# Altium schematic sheet 03 TF CARD, SATA.SchDoc
size 513 x 386 mm
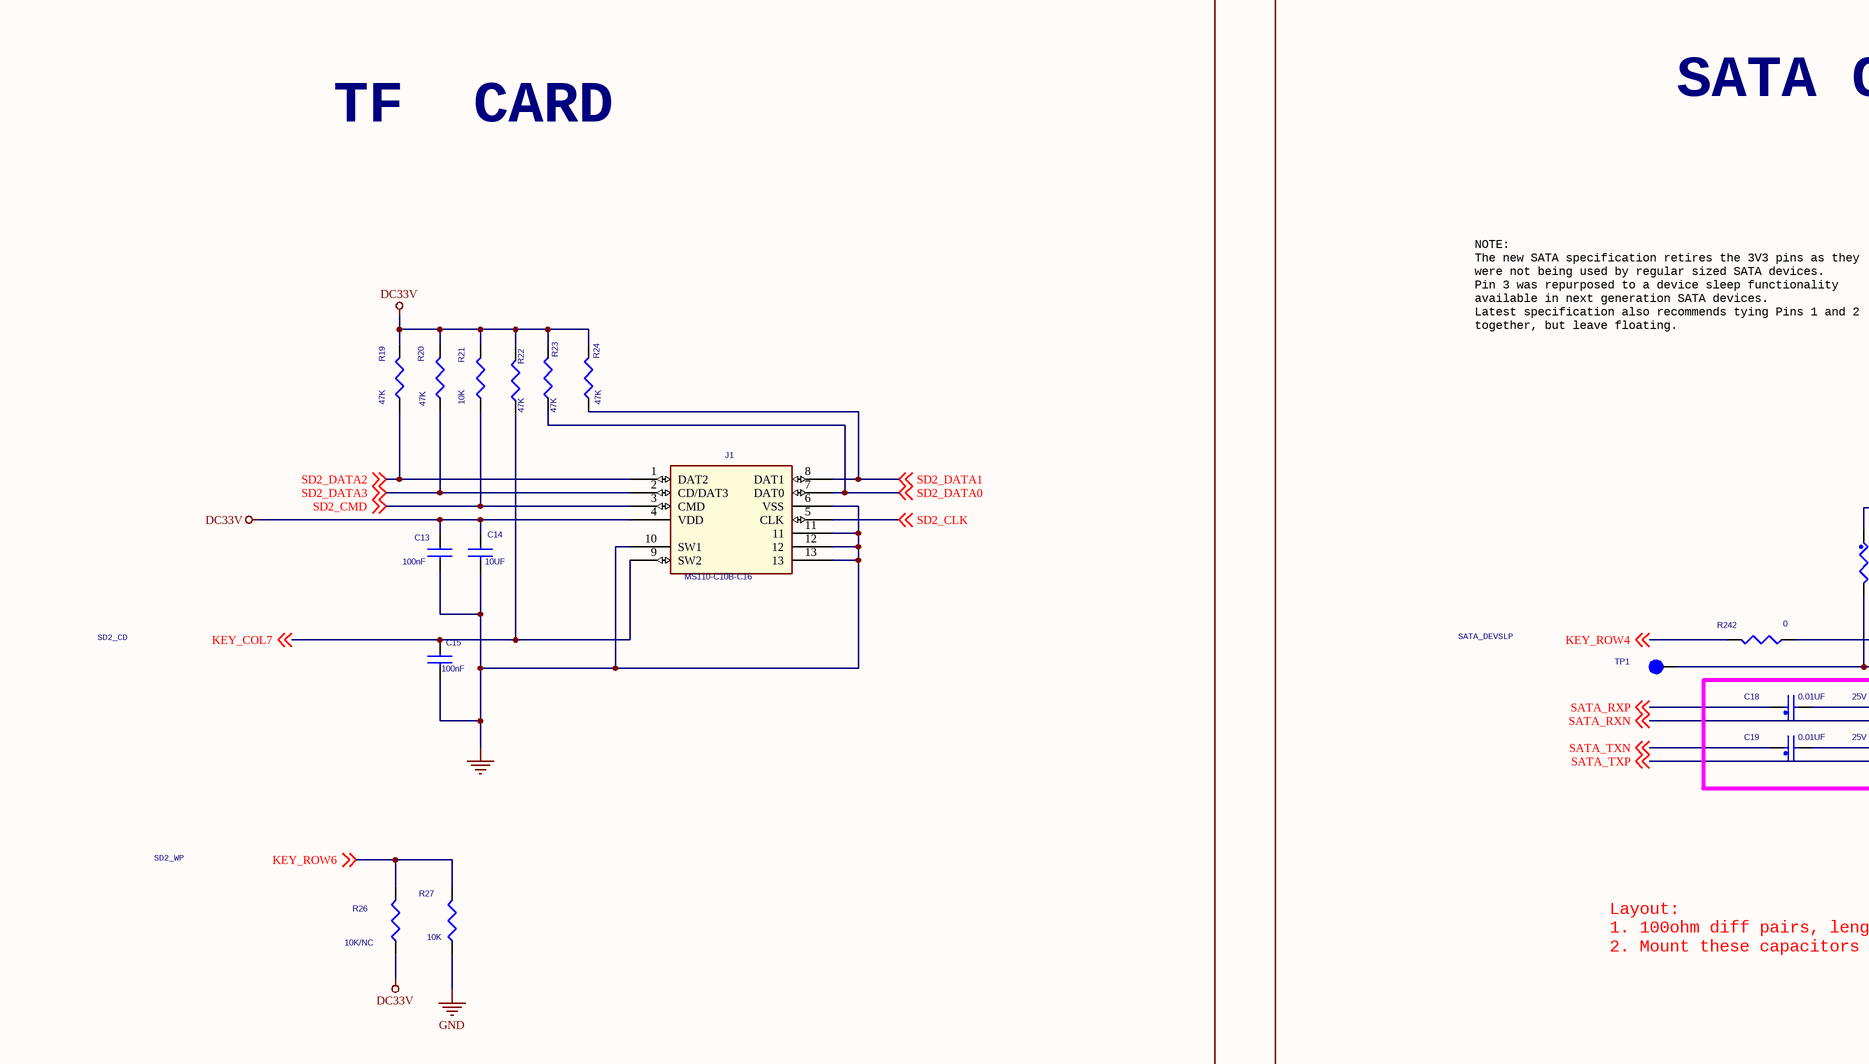
[diagram p0: 03 TF CARD, SATA.SchDoc, top left]
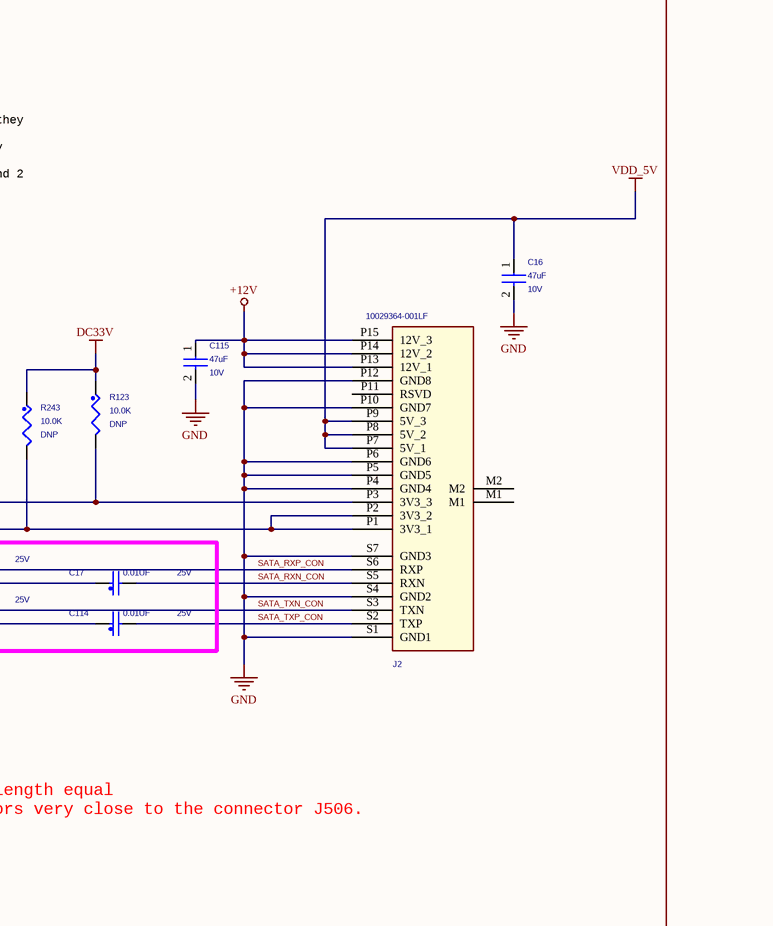
[diagram p1: 03 TF CARD, SATA.SchDoc, top right]
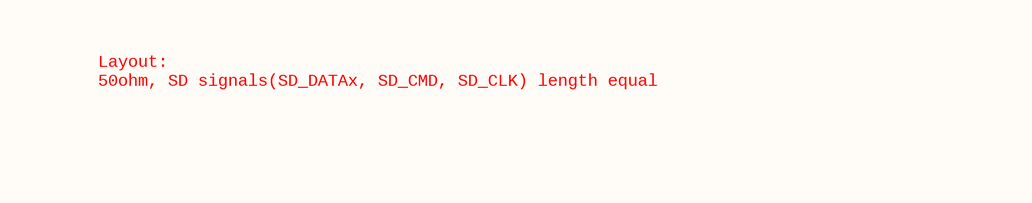
[diagram p2: 03 TF CARD, SATA.SchDoc, bottom left]
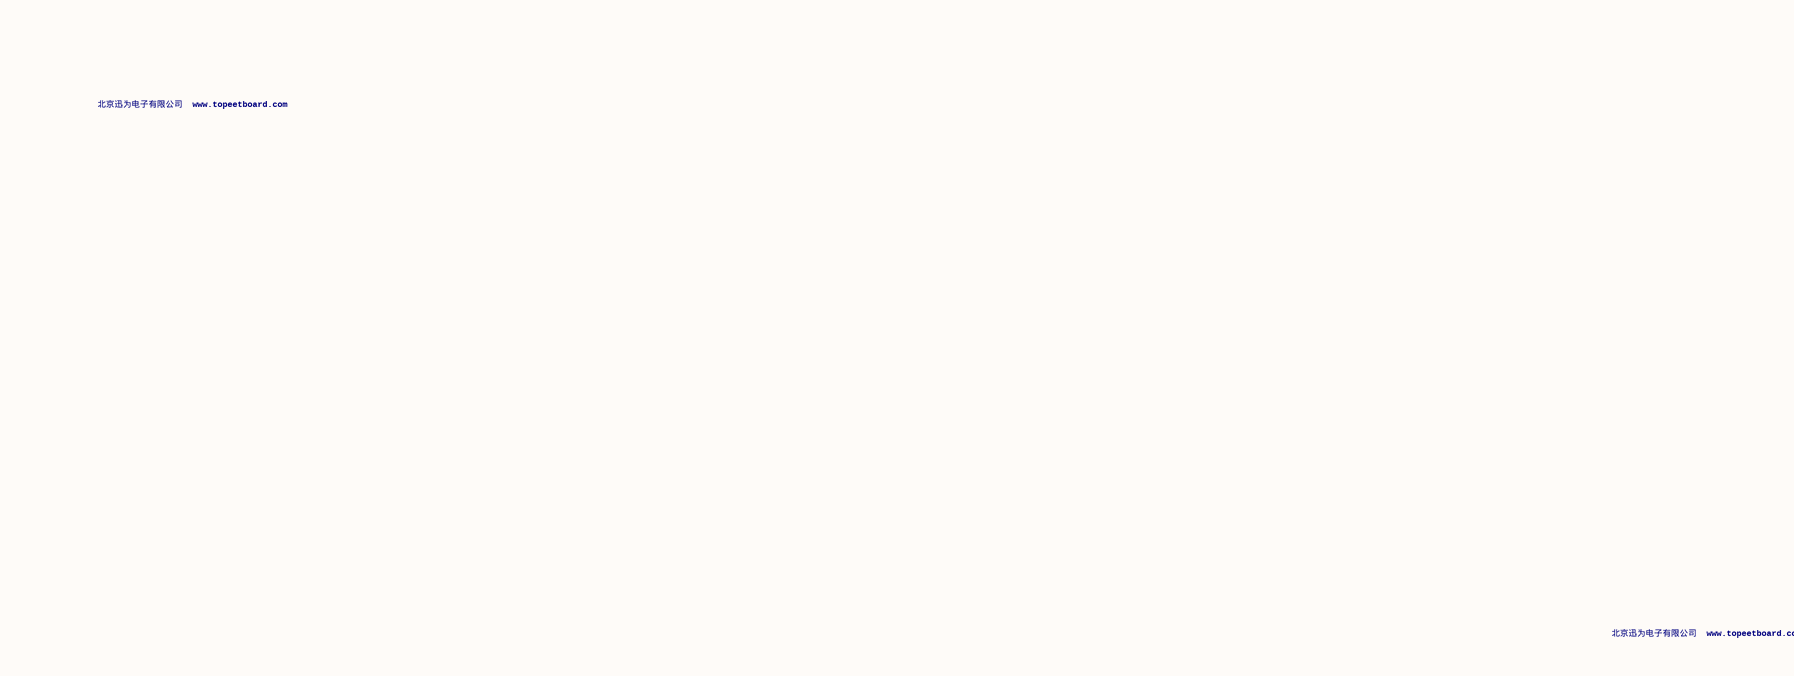
[diagram p3: 03 TF CARD, SATA.SchDoc, bottom right]

## Parts
C13  100nF  [C0402]
C14  10UF  [C0402]
C15  100nF  [C0402]
C16  47uF  WVDC: 10V  [C0805]
C17  0.01UF  WVDC: 25V  [C0402]
C18  0.01UF  WVDC: 25V  [C0402]
C19  0.01UF  WVDC: 25V  [C0402]
C114  0.01UF  WVDC: 25V  [C0402]
C115  47uF  WVDC: 10V  [C0805]
J1  MS110-C10B-C16  [TF-CARD]
J2  10029364-001LF  [con_sata_22f_50_sm_ra_a2]
R19  47K  [R1005]
R20  47K  [R1005]
R21  10K  [R1005]
R22  47K  [R1005]
R23  47K  [R1005]
R24  47K  [R1005]
R26  10K/NC  [R1005]
R27  10K  [R1005]
R123  10.0K  ASSY_OPT: DNP  [R0402]
R242  0  [R0402]
R243  10.0K  ASSY_OPT: DNP  [R0402]
TP1  tpad_020  [tpad_020]  (value not drawn)

## Blocks framed on the sheet
TF  CARD: C13-C15 J1 R19-R24 R26 R27
SATA CONNECTOR: C16-C19 C114 C115 J2 R123 R242 R243 TP1

## Nets
+12V: C115.1 J2.P13(12V_1) J2.P14(12V_2) J2.P15(12V_3)
DC33V: C13.1 C14.1 J1.4(VDD) R19.2 R20.2 R21.2 R22.2 R23.2 R24.2 R26.1 R123.1 R243.1
GND: C13.2 C14.2 C15.2 C16.2 C115.2 J1.6(VSS) J1.10(SW1) J1.11 J1.12 J1.13 J2.P4(GND4) J2.P5(GND5) J2.P6(GND6) J2.P10(GND7) J2.P12(GND8) J2.S1(GND1) J2.S4(GND2) J2.S7(GND3) R27.1
VDD_5V: C16.1 J2.P7(5V_1) J2.P8(5V_2) J2.P9(5V_3)
KEY_COL7: C15.1 J1.9(SW2) R22.1 ; off-sheet KEY_COL7
KEY_ROW4: R242.2 ; off-sheet KEY_ROW4
KEY_ROW6: R26.2 R27.2 ; off-sheet KEY_ROW6
SATA_RXN: C17.1 ; off-sheet SATA_RXN
SATA_RXN_CON: C17.2 J2.S5(RXN)
SATA_RXP: C18.1 ; off-sheet SATA_RXP
SATA_RXP_CON: C18.2 J2.S6(RXP)
SATA_TXN: C19.1 ; off-sheet SATA_TXN
SATA_TXN_CON: C19.2 J2.S3(TXN)
SATA_TXP: C114.1 ; off-sheet SATA_TXP
SATA_TXP_CON: C114.2 J2.S2(TXP)
SD2_CLK: J1.5(CLK) ; off-sheet SD2_CLK
SD2_CMD: J1.3(CMD) R21.1 ; off-sheet SD2_CMD
SD2_DATA0: J1.7(DAT0) R23.1 ; off-sheet SD2_DATA0
SD2_DATA1: J1.8(DAT1) R24.1 ; off-sheet SD2_DATA1
SD2_DATA2: J1.1(DAT2) R19.1 ; off-sheet SD2_DATA2
SD2_DATA3: J1.2(CD/DAT3) R20.1 ; off-sheet SD2_DATA3
NetJ2_P1: J2.P1(3V3_1) J2.P2(3V3_2) R243.2 TP1.1(Pin1)
NetJ2_P3: J2.P3(3V3_3) R123.2 R242.1

Not connected (* = marked no-connect by the designer): J2 M1 M2 P11(RSVD)

## Notes on the sheet
- NOTE:
  The new SATA specification retires the 3V3 pins as they
  were not being used by regular sized SATA devices.
  Pin 3 was repurposed to a device sleep functionality
  available in next generation SATA devices.
  Latest specification also recommends tying Pins 1 and 2
  together, but leave floating.
- SD2_CD
- SATA_DEVSLP
- SD2_WP
- Layout:
  1. 100ohm diff pairs, length equal
  2. Mount these capacitors very close to the connector J506.
- Layout:
  50ohm, SD signals(SD_DATAx, SD_CMD, SD_CLK) length equal
- 北京迅为电子有限公司  www.topeetboard.com

## Library data of the parts
C13-C15 = C0402_0
  C13 C15: Description: 100nF
  C14: Description: 10UF
C16 = MOT_CAP: CAP CER 47uF 10V 20% X5R 1206; FPLIST: CC1206_OV,CC1206,1206_CC; CAD_APPROVED: Yes; MFG_PN01: LMK316BJ476ML-T; MFG_NAME01: TAIYO YUDEN; AGILE_PN: 150-78578; SIGNAL_MODEL: DEFAULT_CAPACITOR_4.7e+07pF_2_1; HEIGHT: 1.80MM; ROHS: Yes; Tolerance: 20%; VOLTAGE: 10V
C17 C114 = CAP_NP: CAP CER 0.01UF 6.3V 10% X7R 0201; SIGNAL_MODEL: DEFAULT_CAPACITOR_10000pF_2_1; FPLIST: CC0201,CC0201_HD,0201_CC,cc_0201_cir; CAD_APPROVED: YES; MFG_PN01: GRM033R70J103KA01D; MFG_NAME01: MURATA; AGILE_PN: 150-75465; VOLTAGE: 6.3V; HEIGHT: 0.33 MM; ROHS: Yes; Tolerance: 10%
C18 C19 = CAP_NP: CAP CER 0.01UF 6.3V 10% X7R 0201; SIGNAL_MODEL: DEFAULT_CAPACITOR_10000pF_2_1; AGILE_PN: 150-75465; MFG_NAME01: MURATA; MFG_PN01: GRM033R70J103KA01D; CAD_APPROVED: YES; FPLIST: CC0201,CC0201_HD,0201_CC,cc_0201_cir; VOLTAGE: 6.3V; Tolerance: 10%; ROHS: Yes; HEIGHT: 0.33 MM
C115 = MOT_CAP: CAP CER 47uF 10V 20% X5R 1206; SIGNAL_MODEL: DEFAULT_CAPACITOR_4.7e+07pF_2_1; AGILE_PN: 150-78578; MFG_NAME01: TAIYO YUDEN; MFG_PN01: LMK316BJ476ML-T; CAD_APPROVED: Yes; FPLIST: CC1206_OV,CC1206,1206_CC; VOLTAGE: 10V; Tolerance: 20%; ROHS: Yes; HEIGHT: 1.80MM
J1 = MS110-C10B-C16_2
J2 = CONN_SATA_22P: CON 22 SATA SKT RA SMT 50MIL SP 221H AU; AGILE_PN: 211-78930; MFG_NAME01: FCI; CAD_APPROVED: Yes; FPLIST: con_sata_22f_50_sm_ra_a,con_sata_22f_50_sm_ra_b; MFG_PN01: 10029364-001LF; ROHS: Yes; HEIGHT: 5.62MM
R19-R24 R26 R27 = R1005_0_Dup2
R123 R243 = RES_Dup1: RES MF 10.0K 1/16W 1% AEC-Q200 0402; SIGNAL_MODEL: DEFAULT_RESISTOR_10000OHM_2_1; AGILE_PN: 470-75416; MFG_NAME01: KOA SPEER; MFG_PN01: RK73H1ETTP1002F; CAD_APPROVED: Yes; FPLIST: RC0402_25,RC0402_HD,0402_CC; Tolerance: 1%; ROHS: Yes
R242 = R_Dup1
TP1 = TESTLOOP: TEST POINT PAD 0.5MM DIA SMT, NO PART TO ORDER; AGILE_PN: 211-77484; ASSY_OPT: DNP; CAD_APPROVED: Yes; ROHS: Yes; HEIGHT: 0.1MM